# EAGLE design fite-controller-1-main (EAGLE 6.5.0)

## Sheet 1 of 2
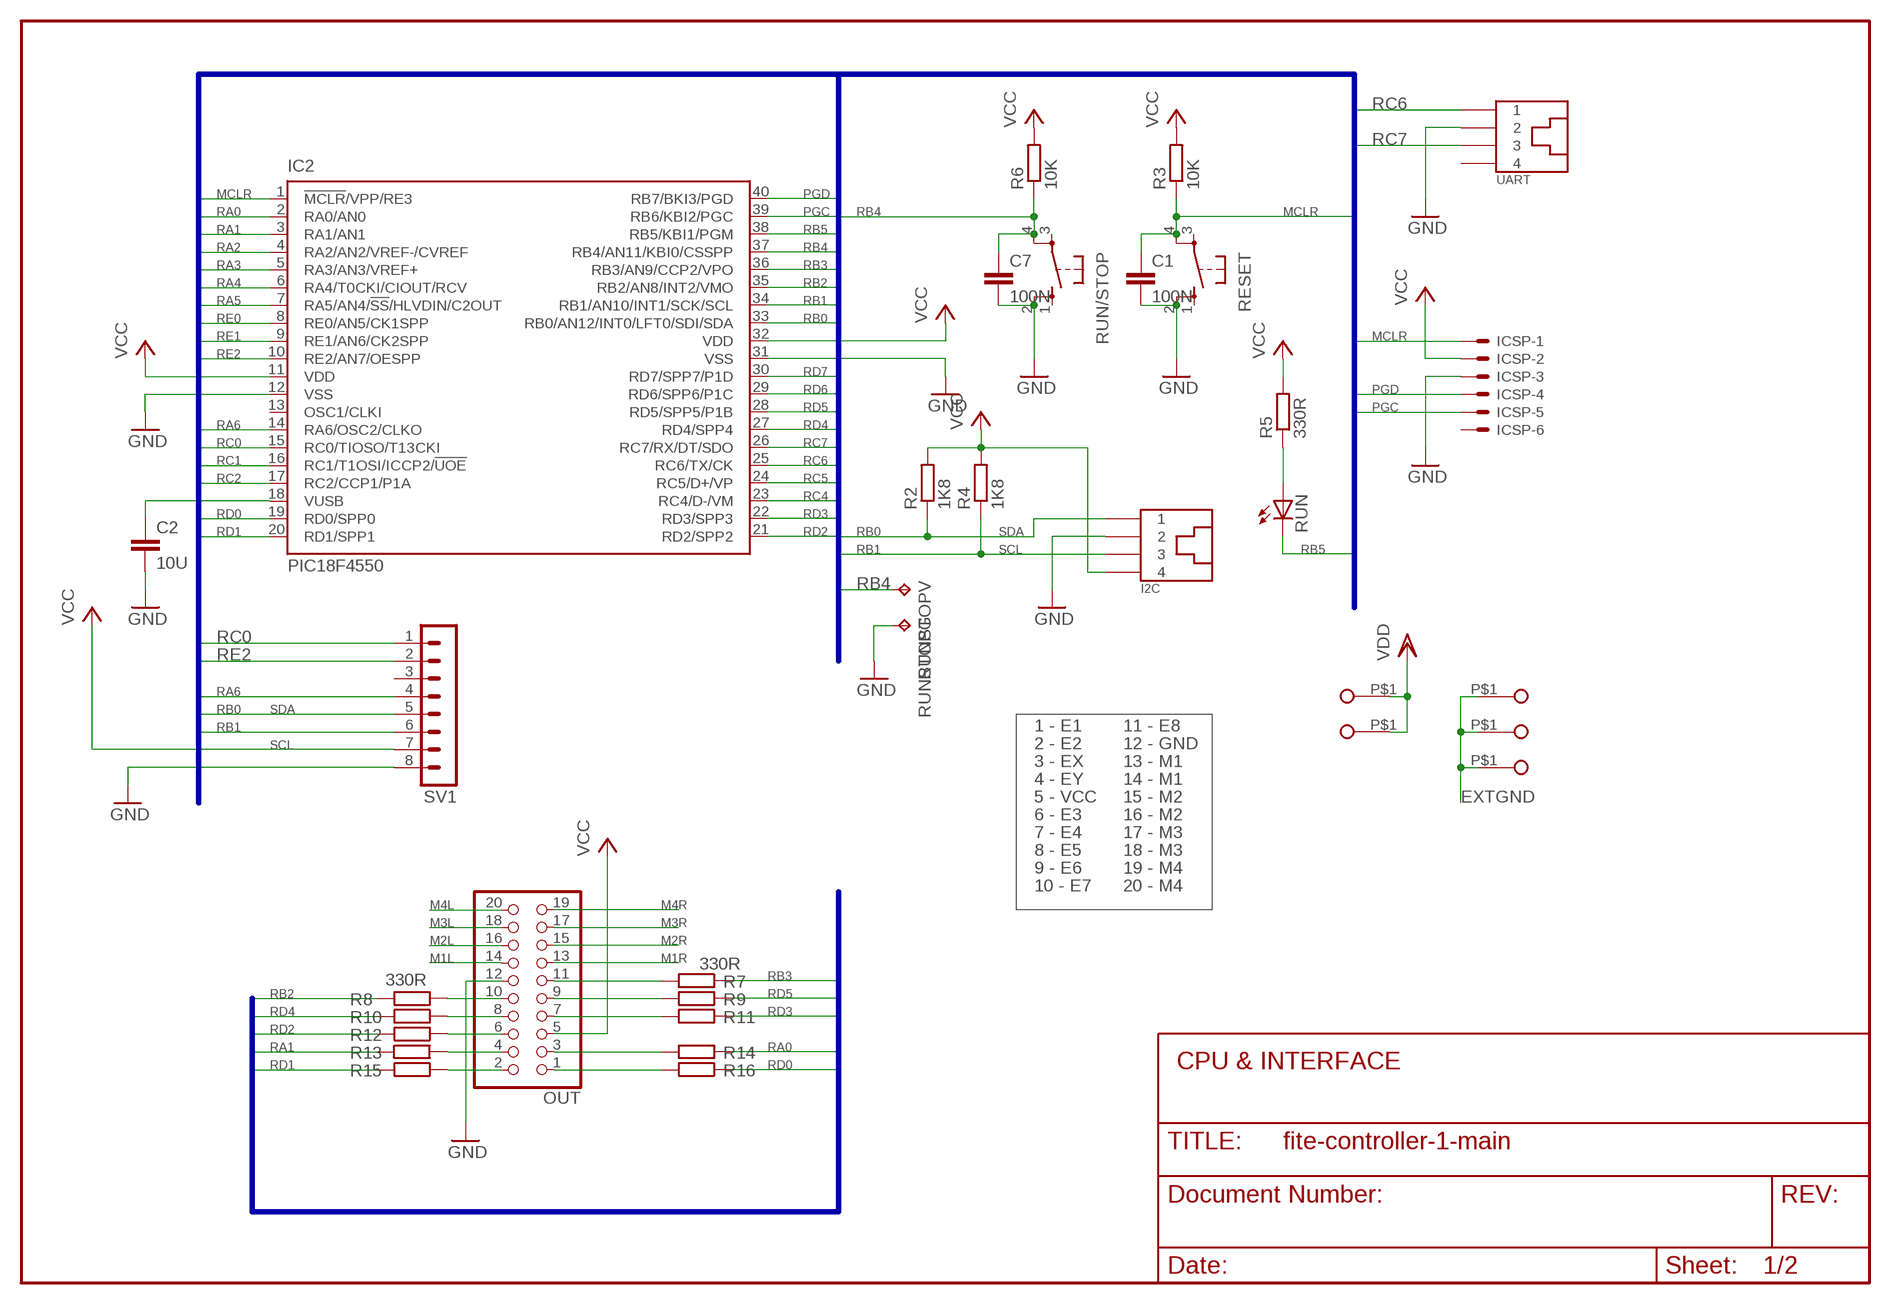
[diagram p0: schematic, sheet 1]

### Parts
C1  100N  C-EU025-025X050  [C025-025X050]
C2  10U  C-EU025-025X050  [C025-025X050]
C7  100N  C-EU025-025X050  [C025-025X050]
I2C  PC_INTERNAL_AUDIO_4  [PC_INTERNAL_AUDIO_4]
IC2  PIC18F4550  PIC18F4550_40  [DIL40]
ICSP  22-23-2061  [22-23-2061]
OUT  PINHD-2X10  [2X10]
R2  1K8  R-EU_0207/10  [0207/10]
R3  10K  R-EU_0207/10  [0207/10]
R4  1K8  R-EU_0207/10  [0207/10]
R5  330R  R-EU_0207/10  [0207/10]
R6  10K  R-EU_0207/10  [0207/10]
R7  330R  R-EU_0207/10  [0207/10]
R8  330R  R-EU_0207/10  [0207/10]
R9  330R  R-EU_0207/10  [0207/10]
R10  330R  R-EU_0207/10  [0207/10]
R11  330R  R-EU_0207/10  [0207/10]
R12  330R  R-EU_0207/10  [0207/10]
R13  330R  R-EU_0207/10  [0207/10]
R14  330R  R-EU_0207/10  [0207/10]
R15  330R  R-EU_0207/10  [0207/10]
R16  330R  R-EU_0207/10  [0207/10]
RESET  10XX  [B3F-10XX]
RUN  LED3MM  [LED3MM]
RUN/STOP  10XX  [B3F-10XX]
RUNSTOPG  TPPAD1-13Y  [P1-13Y]
RUNSTOPV  TPPAD1-13Y  [P1-13Y]
SV1  MA08-1  [MA08-1]
UART  PC_INTERNAL_AUDIO_4  [PC_INTERNAL_AUDIO_4]
VBB_GND_1  FITE_HUELSE  [HUELSE_3.2MM]
VDD_1  FITE_HUELSE  [HUELSE_3.2MM]
VDD_2  FITE_HUELSE  [HUELSE_3.2MM]
VDD_GND  FITE_HUELSE  [HUELSE_3.2MM]
VDD_GND_2  FITE_HUELSE  [HUELSE_3.2MM]

### Nets
EXTGND: VBB_GND_1.P$1 VDD_GND.P$1 VDD_GND_2.P$1 ; also sheet 2
GND: C1.2 C2.2 C7.2 I2C.P$2 IC2.12(VSS) IC2.31(VSS) ICSP.3 OUT.12 RESET.2 RUN/STOP.2 RUNSTOPG.TP SV1.8 UART.P$2 ; also sheet 2
LEDRUN-01: R5.1 RUN.A
M1L: OUT.14 ; also sheet 2
M1R: OUT.13 ; also sheet 2
M2L: OUT.16 ; also sheet 2
M2R: OUT.15 ; also sheet 2
M3L: OUT.18 ; also sheet 2
M3R: OUT.17 ; also sheet 2
M4L: OUT.20 ; also sheet 2
M4R: OUT.19 ; also sheet 2
MCLR: C1.1 IC2.1(!MCLR!/VPP/RE3) ICSP.1 R3.1 RESET.4
N$1: C2.1 IC2.18(VUSB)
N$3: OUT.10 R8.1
N$4: OUT.8 R10.1
N$5: OUT.6 R12.1
N$6: OUT.4 R13.2
N$7: OUT.2 R15.1
N$8: OUT.11 R7.2
N$9: OUT.9 R9.2
N$10: OUT.7 R11.2
N$11: OUT.3 R14.2
N$12: OUT.1 R16.2
PGC: IC2.39(RB6/KBI2/PGC) ICSP.5
PGD: IC2.40(RB7/BKI3/PGD) ICSP.4
RA0: IC2.2(RA0/AN0) R14.1
RA1: IC2.3(RA1/AN1) R13.1
RA2: IC2.4(RA2/AN2/VREF-/CVREF) ; also sheet 2
RA3: IC2.5(RA3/AN3/VREF+) ; also sheet 2
RA4: IC2.6(RA4/T0CKI/CIOUT/RCV) ; also sheet 2
RA5: IC2.7(RA5/AN4/!SS!/HLVDIN/C2OUT) ; also sheet 2
RA6: IC2.14(RA6/OSC2/CLKO) SV1.4
RB0: I2C.P$1 IC2.33(RB0/AN12/INT0/LFT0/SDI/SDA) R2.1 SV1.5
RB1: I2C.P$3 IC2.34(RB1/AN10/INT1/SCK/SCL) R4.1 SV1.6
RB2: IC2.35(RB2/AN8/INT2/VMO) R8.2
RB3: IC2.36(RB3/AN9/CCP2/VPO) R7.1
RB4: C7.1 IC2.37(RB4/AN11/KBI0/CSSPP) R6.1 RUN/STOP.4 RUNSTOPV.TP
RB5: IC2.38(RB5/KBI1/PGM) RUN.K(C)
RC0: IC2.15(RC0/TIOSO/T13CKI) SV1.1
RC1: IC2.16(RC1/T1OSI/ICCP2/!UOE) ; also sheet 2
RC2: IC2.17(RC2/CCP1/P1A) ; also sheet 2
RC4: IC2.23(RC4/D-/VM) ; also sheet 2
RC5: IC2.24(RC5/D+/VP) ; also sheet 2
RC6: IC2.25(RC6/TX/CK) UART.P$1
RC7: IC2.26(RC7/RX/DT/SDO) UART.P$3
RD0: IC2.19(RD0/SPP0) R16.1
RD1: IC2.20(RD1/SPP1) R15.2
RD2: IC2.21(RD2/SPP2) R12.2
RD3: IC2.22(RD3/SPP3) R11.1
RD4: IC2.27(RD4/SPP4) R10.2
RD5: IC2.28(RD5/SPP5/P1B) R9.1
RD6: IC2.29(RD6/SPP6/P1C) ; also sheet 2
RD7: IC2.30(RD7/SPP7/P1D) ; also sheet 2
RE0: IC2.8(RE0/AN5/CK1SPP) ; also sheet 2
RE1: IC2.9(RE1/AN6/CK2SPP) ; also sheet 2
RE2: IC2.10(RE2/AN7/OESPP) SV1.2
VCC: I2C.P$4 IC2.11(VDD) IC2.32(VDD) ICSP.2 OUT.5 R2.2 R3.2 R4.2 R5.2 R6.2 SV1.7 ; also sheet 2
VDD: VDD_1.P$1 VDD_2.P$1 ; also sheet 2
Unconnected: IC2.13(OSC1/CLKI) ICSP.6 RESET.1 RESET.3 RUN/STOP.1 RUN/STOP.3 SV1.3 UART.P$4

### Buses
PICBUS:RA[0..7],RB[0..7],RC[0..7],RD[0..7],RE[0..2],MCLR,PGD,PGC

### Notes on the sheet
- SDA
- SCL
- SDA
- 1 - E1 | 11 - E8
- SCL | 2 - E2 | 12 - GND
- 3 - EX | 13 - M1
- 4 - EY | 14 - M1
- 5 - VCC | 15 - M2
- 6 - E3 | 16 - M2
- 7 - E4 | 17 - M3
- 8 - E5 | 18 - M3
- 9 - E6 | 19 - M4
- 10 - E7 | 20 - M4
- CPU & INTERFACE

## Sheet 2 of 2
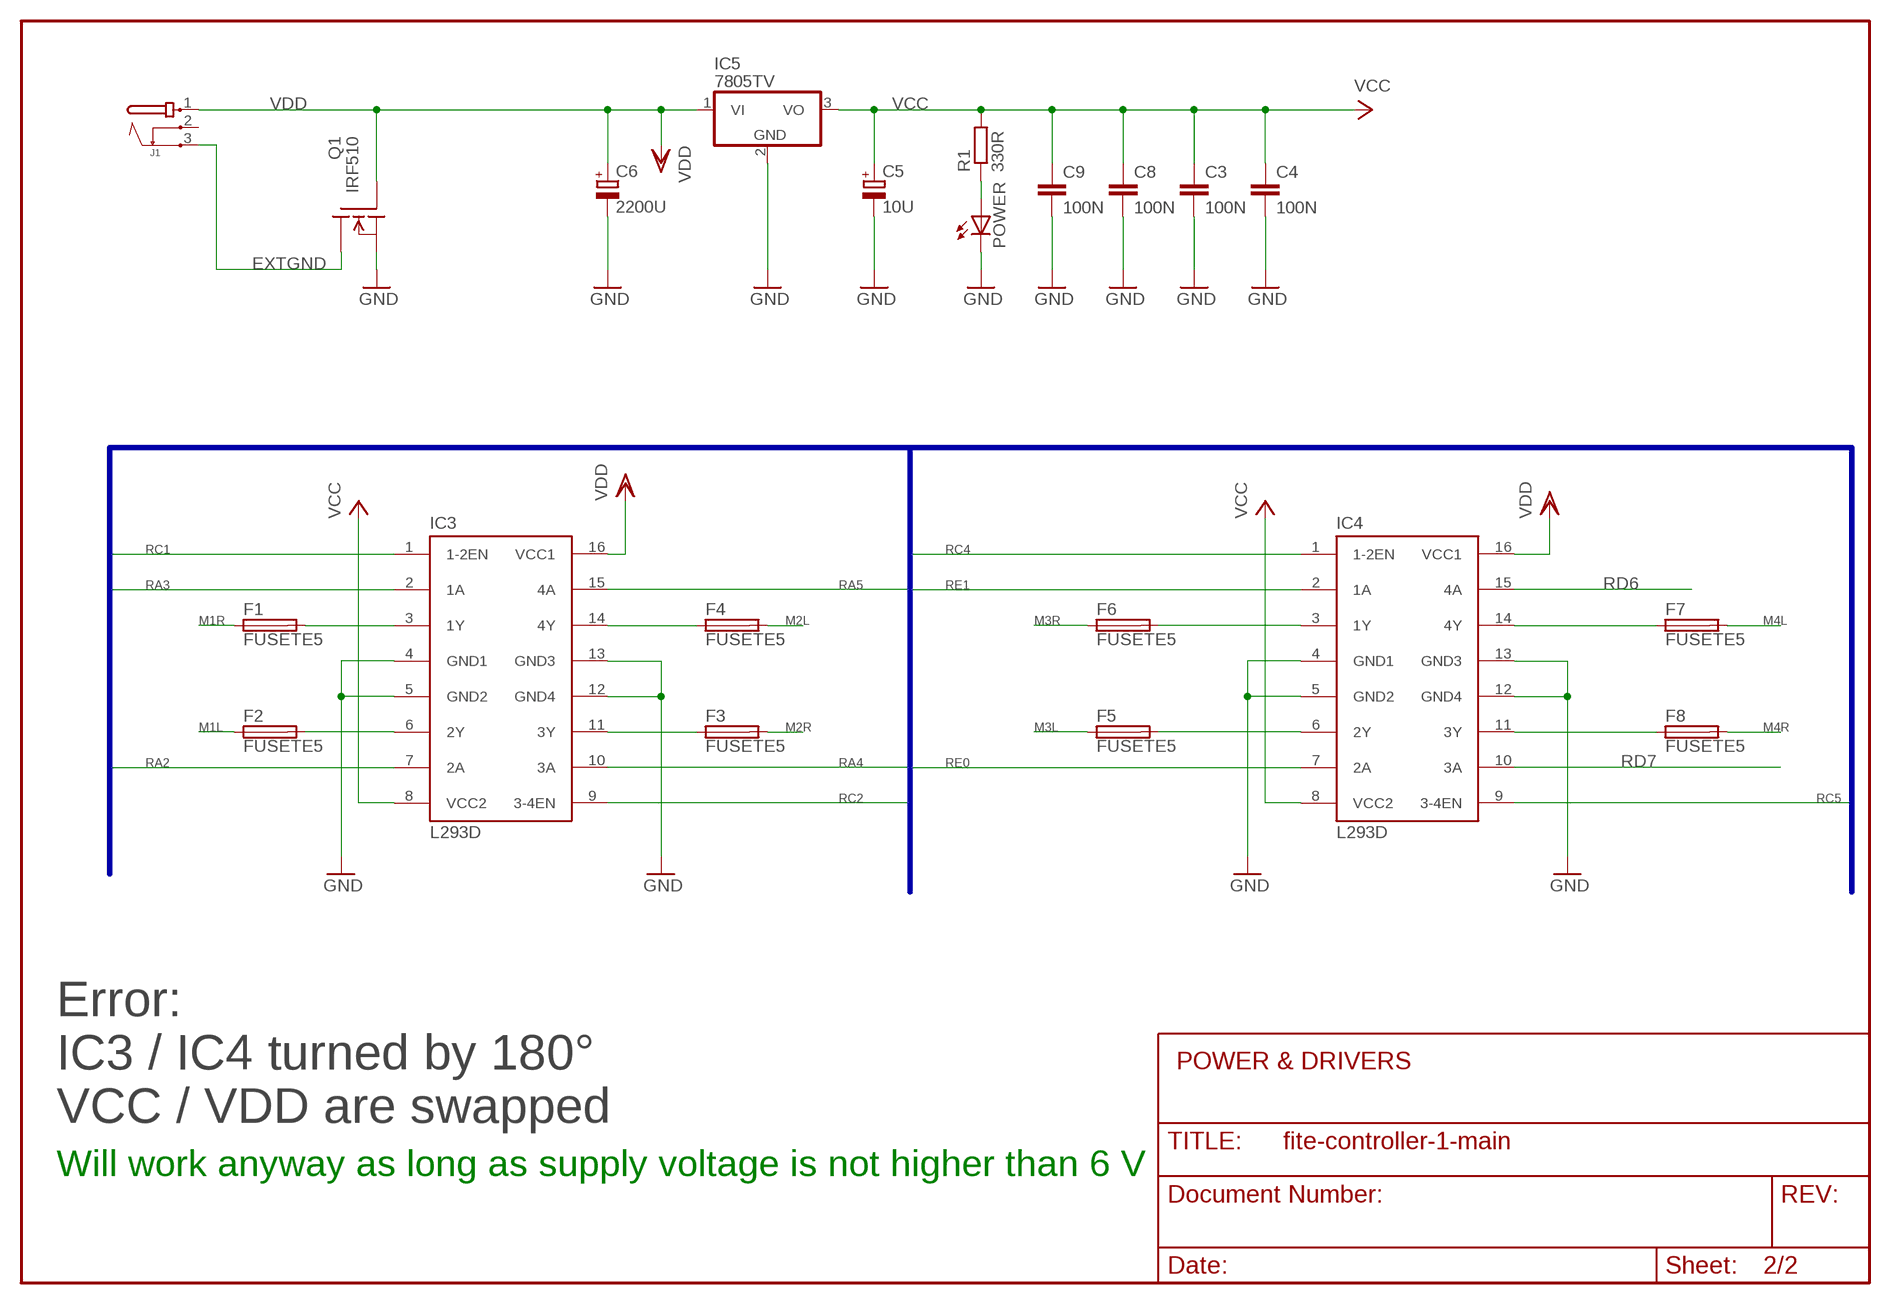
[diagram p1: schematic, sheet 2]

### Parts
C3  100N  C-EU025-025X050  [C025-025X050]
C4  100N  C-EU025-025X050  [C025-025X050]
C5  10U  CPOL-EUE2-4  [E2-4]
C6  2200U  CPOL-EUE3.5-10  [E3,5-10]
C8  100N  C-EU025-025X050  [C025-025X050]
C9  100N  C-EU025-025X050  [C025-025X050]
F1  FUSETE5  [TE5]
F2  FUSETE5  [TE5]
F3  FUSETE5  [TE5]
F4  FUSETE5  [TE5]
F5  FUSETE5  [TE5]
F6  FUSETE5  [TE5]
F7  FUSETE5  [TE5]
F8  FUSETE5  [TE5]
IC3  L293D  L293E  [DIL16]
IC4  L293D  L293E  [DIL16]
IC5  7805TV  [TO220V]
J1  JACK-PMS  [JACK-PMS]
POWER  LED3MM  [LED3MM]
Q1  IRF510  [TO220]
R1  330R  R-EU_0207/10  [0207/10]

### Nets
EXTGND: J1.3 Q1.2(D) ; also sheet 1
GND: C3.2 C4.2 C5.- C6.- C8.2 C9.2 IC3.4(GND1) IC3.5(GND2) IC3.12(GND4) IC3.13(GND3) IC4.4(GND1) IC4.5(GND2) IC4.12(GND4) IC4.13(GND3) IC5.2(GND) POWER.K(C) Q1.3(S) ; also sheet 1
LEDPWR-01: POWER.A R1.1
M1L: F2.1 ; also sheet 1
M1L-01: F2.2 IC3.6(2Y)
M1R: F1.1 ; also sheet 1
M1R-01: F1.2 IC3.3(1Y)
M2L: F4.2 ; also sheet 1
M2L-01: F4.1 IC3.14(4Y)
M2R: F3.2 ; also sheet 1
M2R-01: F3.1 IC3.11(3Y)
M3L: F5.1 ; also sheet 1
M3L-01: F5.2 IC4.6(2Y)
M3R: F6.1 ; also sheet 1
M3R-01: F6.2 IC4.3(1Y)
M4L: F7.2 ; also sheet 1
M4L-01: F7.1 IC4.14(4Y)
M4R: F8.2 ; also sheet 1
M4R-01: F8.1 IC4.11(3Y)
RA2: IC3.7(2A) ; also sheet 1
RA3: IC3.2(1A) ; also sheet 1
RA4: IC3.10(3A) ; also sheet 1
RA5: IC3.15(4A) ; also sheet 1
RC1: IC3.1(1-2EN) ; also sheet 1
RC2: IC3.9(3-4EN) ; also sheet 1
RC4: IC4.1(1-2EN) ; also sheet 1
RC5: IC4.9(3-4EN) ; also sheet 1
RD6: IC4.15(4A) ; also sheet 1
RD7: IC4.10(3A) ; also sheet 1
RE0: IC4.7(2A) ; also sheet 1
RE1: IC4.2(1A) ; also sheet 1
VCC: C3.1 C4.1 C5.+ C8.1 C9.1 IC3.8(VCC2) IC4.8(VCC2) IC5.3(VO) R1.2 ; also sheet 1
VDD: C6.+ IC3.16(VCC1) IC4.16(VCC1) IC5.1(VI) J1.1 Q1.1(G) ; also sheet 1
Unconnected: J1.2

### Buses
PICBUS:RA[0..7],RB[0..7],RC[0..7],RD[0..7],RE[0..2],MCLR,PGD,PGC

### Notes on the sheet
- Error:
- IC3 / IC4 turned by 180° | POWER & DRIVERS
- VCC / VDD are swapped
- Will work anyway as long as supply voltage is not higher than 6 V

## Library data of the parts
C1-C4 C7-C9 = turbod3:C-EU: CAPACITOR, European symbol
C5 C6 = rcl:CPOL-EU: POLARIZED CAPACITOR, European symbol
F1-F8 = fuse:FUSE: Fuse; OC_FARNELL: unknown; OC_NEWARK: unknown
I2C UART = turbod3:PC_INTERNAL_AUDIO_4
IC2 = microchip:PIC18F4*_40: USB Microcontrollers with nanoWatt Technology High-Performance, Enhanced Flash, 28/40/44-Pin, Source: http://ww1.microchip.com/downloads/en/devicedoc/39632c.pdf; MF: MICROCHIP; MPN: PIC18F4550-I/P; OC_FARNELL: 9321357; OC_NEWARK: 74K8623
IC3 IC4 = texas:L293E: TI DEVICE; MF: Arrow Electronics; MPN: L293E; OC_FARNELL: 1467711; OC_NEWARK: 89K0732
IC5 = linear:78*: Positive VOLTAGE REGULATOR Source: http://cache.national.com/ds/LM/LM78L05.pdf http://www.fairchildsemi.com/ds/LM/LM7805.pdf
ICSP = con-molex:22-23-2061: .100" (2.54mm) Center Header - 6 Pin; MF: MOLEX; MPN: 22-23-2061; OC_FARNELL: 1462922; OC_NEWARK: 27C1933
J1 = POWER-IN:JACK-PMS
OUT = pinhead:PINHD-2X10: PIN HEADER
POWER RUN = led:LED: LED OSRAM: - CHIPLED LG R971, LG N971, LY N971, LG Q971, LY Q971, LO R971, LY R971 LH N974, LH R974 LS Q976, LO Q976, LY Q976 LO Q996 - Hyper CHIPLED LW Q18S LB Q993, LB Q99A, LB R99A - SideLED LS A670, LO A670, LY A670, LG A670, LP A670 LB A673, LV A673, LT A673, LW A673 LH A674 LY A675 LS A676, LA A676, LO A676, LY A676, LW A676 LS A679, LY A679, LG A679 - Hyper Micro SIDELED® LS Y876, LA Y876, LO Y876, LY Y876 LT Y87S - SmartLED LW L88C, LW L88S LB L89C, LB L89S, LG L890 LS L89K, LO L89K, LY L89K LS L896, LA L896, LO L896, LY L896 - TOPLED LS T670, LO T670, LY T670, LG T670, LP T670 LSG T670, LSP T670, LSY T670, LOP T670, LYG T670 LG T671, LOG T671, LSG T671 LB T673, LV T673, LT T673, LW T673 LH T674 LS T676, LA T676, LO T676, LY T676, LB T676, LH T676, LSB T676, LW T676 LB T67C, LV T67C, LT T67C, LS T67K, LO T67K, LY T67K, LW E67C LS E67B, LA E67B, LO E67B, LY E67B, LB E67C, LV E67C, LT E67C LW T67C LS T679, LY T679, LG T679 LS T770, LO T770, LY T770, LG T770, LP T770 LB T773, LV T773, LT T773, LW T773 LH T774 LS E675, LA E675, LY E675, LS T675 LS T776, LA T776, LO T776, LY T776, LB T776 LHGB T686 LT T68C, LB T68C - Hyper Mini TOPLED® LB M676 - Mini TOPLED Santana® LG M470 LS M47K, LO M47K, LY M47K Source: http://www.osram.convergy.de LUXEON: - LUMILED® LXK2-PW12-R00, LXK2-PW12-S00, LXK2-PW14-U00, LXK2-PW14-V00 LXK2-PM12-R00, LXK2-PM12-S00, LXK2-PM14-U00 LXK2-PE12-Q00, LXK2-PE12-R00, LXK2-PE12-S00, LXK2-PE14-T00, LXK2-PE14-U00 LXK2-PB12-K00, LXK2-PB12-L00, LXK2-PB12-M00, LXK2-PB14-N00, LXK2-PB14-P00, LXK2-PB14-Q00 LXK2-PR12-L00, LXK2-PR12-M00, LXK2-PR14-Q00, LXK2-PR14-R00 LXK2-PD12-Q00, LXK2-PD12-R00, LXK2-PD12-S00 LXK2-PH12-R00, LXK2-PH12-S00 LXK2-PL12-P00, LXK2-PL12-Q00, LXK2-PL12-R00 Source: www.luxeon.com KINGBRIGHT: KA-3528ASYC Source: www.kingbright.com
Q1 = transistor-fet:IRF510: N-Channel Enhancement MOSFET (HEXFET); 100V; 5,6A; 0,54Ohm
R1-R16 = turbod3:R-EU_: RESISTOR, European symbol
RESET RUN/STOP = turbod3:10XX
RUNSTOPG RUNSTOPV = testpad:TP: Test pad
SV1 = con-lstb:MA08-1: PIN HEADER; OC_FARNELL: unknown; OC_NEWARK: unknown
VBB_GND_1 VDD_1 VDD_2 VDD_GND VDD_GND_2 = turbod3:FITE_HUELSE

## Board
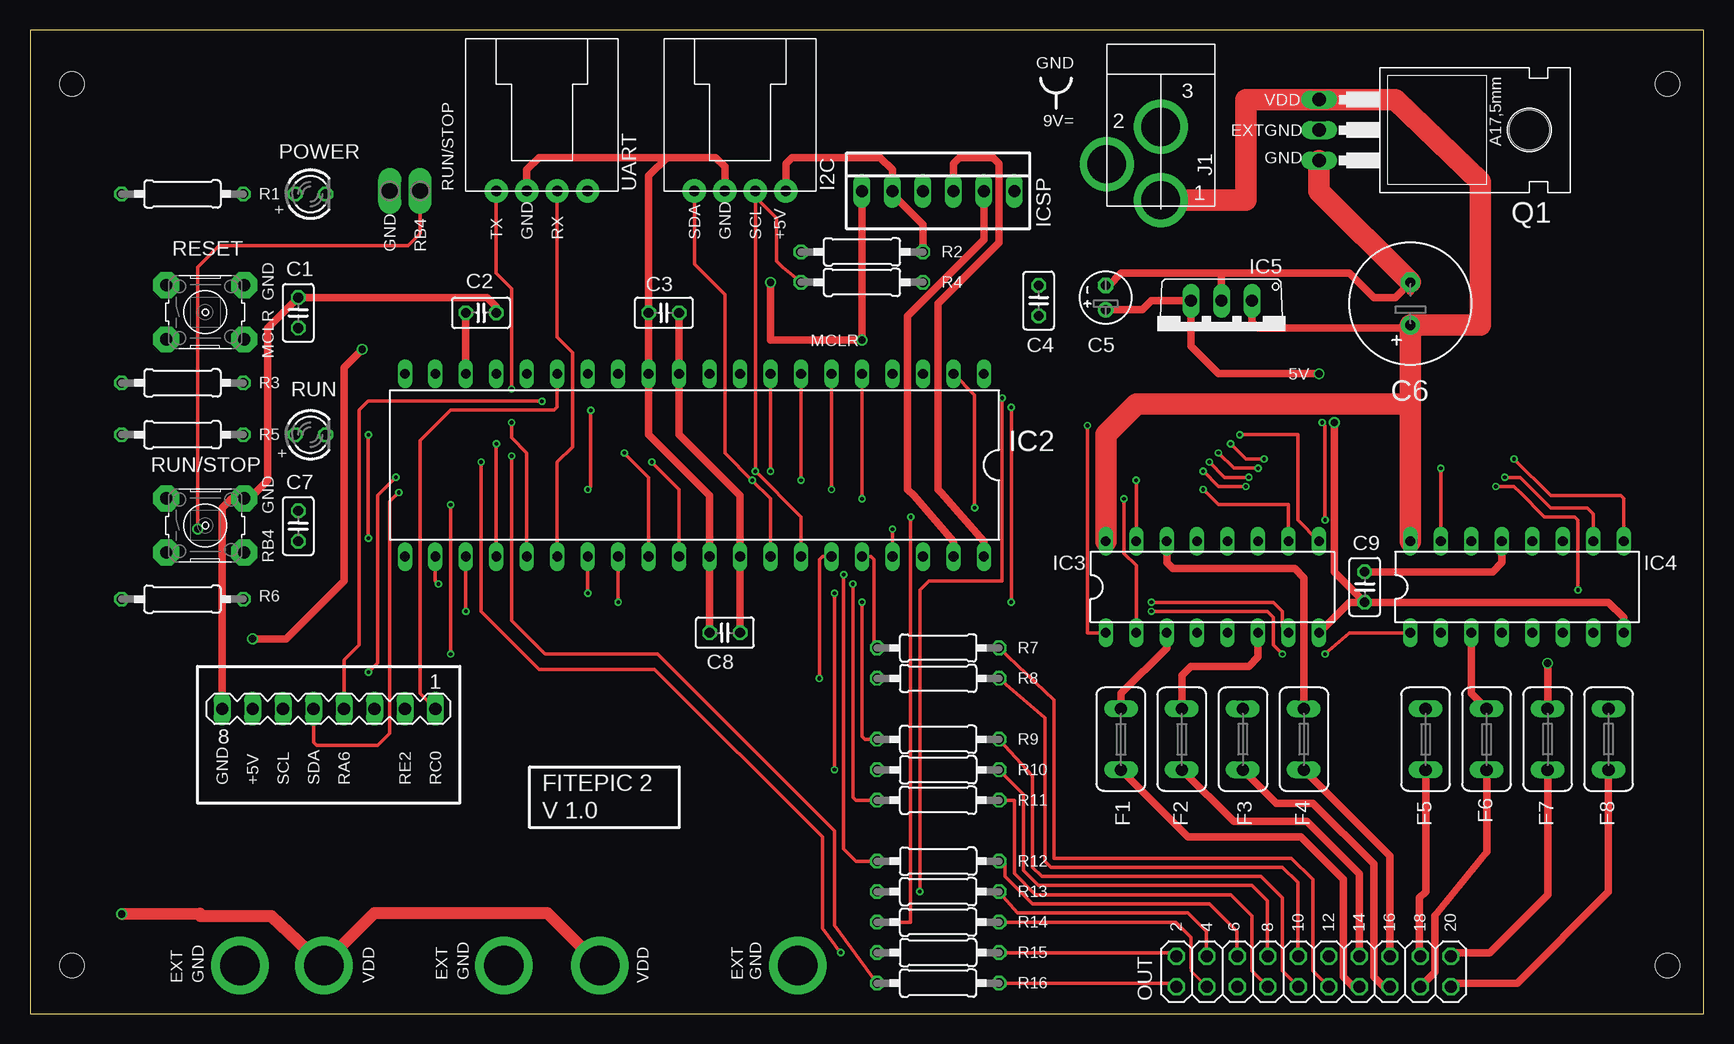
[diagram p2: board, top side]
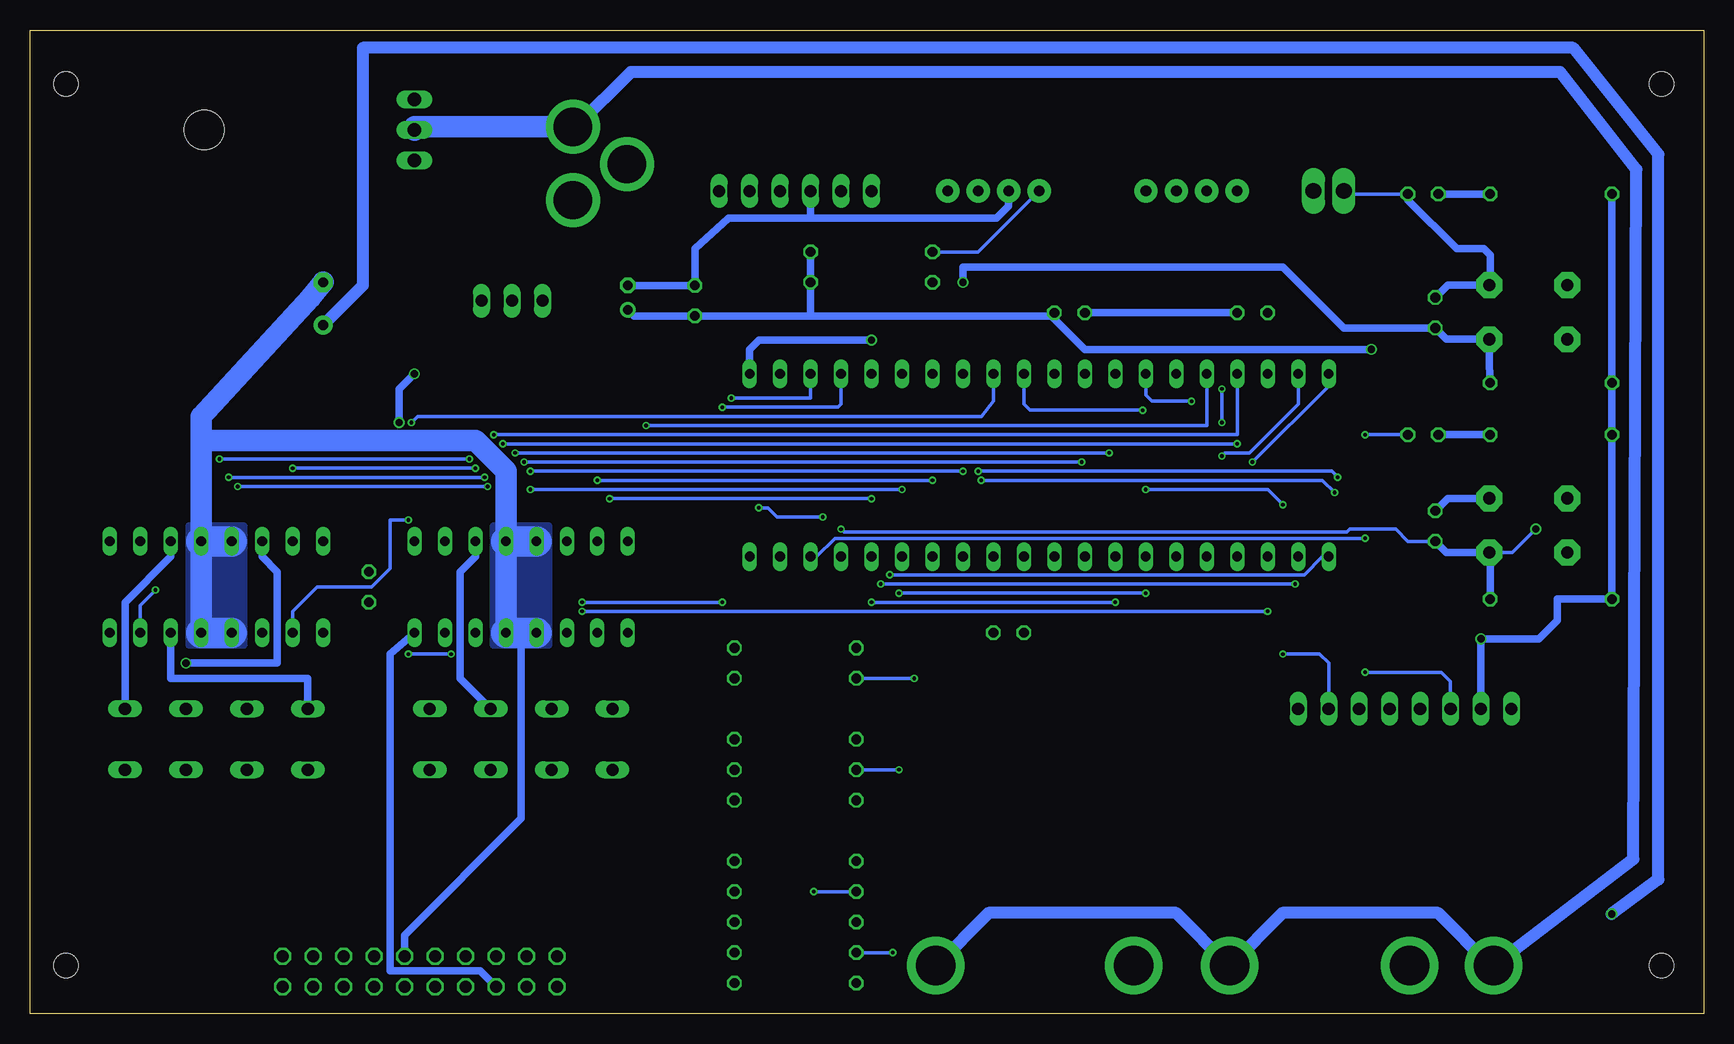
[diagram p3: board, bottom side, seen from below]

Size 139.5 x 82 mm. Coordinates in mm from the lower left corner, seen from the top.
Outline: 0,0 139.5,0 139.5,82 0,82 0,0
Copper layers (1*16): Top 0.035mm / dielectric 1.5mm / Bottom 0.035mm
Design rules "PCB-POOL Standard": minimum track width 0.15mm, minimum drill 0.3mm, track to track 0.15mm, track to pad 0.15mm, pad to pad 0.15mm, via to via 0.15mm, smd to smd 0.15mm, copper to edge 0.3mm, drill to drill 0.2mm, minimum pad ring 0.2mm, minimum via ring 0.15mm, stop-mask expansion 0.075mm, vias tented up to drill 0mil, thermal gap 0.2mm
Holes 2 mm at 3.5,77.5 3.5,4 136.5,77.5 136.5,4

### Footprints (pad centres in the part's own frame; a part is rotated, then mirrored left to right if it is on the bottom)
C025-025X050 = drill 0.813 octagon: 1 -1.27,0; 2 1.27,0
E2-4 = drill 0.813 pad 1.27 round: + -1.016,0 | drill 0.813 pad 1.27 octagon: - 1.016,0
E3,5-10 = drill 0.813 pad 1.6 round: + -1.778,0 | drill 0.813 pad 1.6 octagon: - 1.778,0
TE5 = drill 1.016 long: 1 -2.54,0; 2 2.54,0
PC_INTERNAL_AUDIO_4 = drill 0.9 pad 1.93 round: P$1 -3.81,-6.35; P$2 -1.27,-6.35; P$3 1.27,-6.35; P$4 3.81,-6.35
DIL40 = drill 0.813 long: 1 -24.13,-7.62; 2 -21.59,-7.62; 3 -19.05,-7.62; 4 -16.51,-7.62; 5 -13.97,-7.62; 6 -11.43,-7.62; 7 -8.89,-7.62; 8 -6.35,-7.62; 9 -3.81,-7.62; 10 -1.27,-7.62; 11 1.27,-7.62; 12 3.81,-7.62; 13 6.35,-7.62; 14 8.89,-7.62; 15 11.43,-7.62; 16 13.97,-7.62; 17 16.51,-7.62; 18 19.05,-7.62; 19 21.59,-7.62; 20 24.13,-7.62; 21 24.13,7.62; 22 21.59,7.62; 23 19.05,7.62; 24 16.51,7.62; 25 13.97,7.62; 26 11.43,7.62; 27 8.89,7.62; 28 6.35,7.62; 29 3.81,7.62; 30 1.27,7.62; 31 -1.27,7.62; 32 -3.81,7.62; 33 -6.35,7.62; 34 -8.89,7.62; 35 -11.43,7.62; 36 -13.97,7.62; 37 -16.51,7.62; 38 -19.05,7.62; 39 -21.59,7.62; 40 -24.13,7.62
DIL16 = drill 0.813 long: 1 -8.89,-3.81; 2 -6.35,-3.81; 3 -3.81,-3.81; 4 -1.27,-3.81; 5 1.27,-3.81; 6 3.81,-3.81; 7 6.35,-3.81; 8 8.89,-3.81; 9 8.89,3.81; 10 6.35,3.81; 11 3.81,3.81; 12 1.27,3.81; 13 -1.27,3.81; 14 -3.81,3.81; 15 -6.35,3.81; 16 -8.89,3.81
TO220V = drill 1.016 long: 1 -2.54,-2.54; 2 0,-2.54; 3 2.54,-2.54
22-23-2061 = drill 1 long: 1 -6.35,0; 2 -3.81,0; 3 -1.27,0; 4 1.27,0; 5 3.81,0; 6 6.35,0
JACK-PMS = drill 3.2 pad 4.5 round: 1 -0.5,-3.31; 2 -5,-0.31; 3 -0.5,2.809
2X10 = drill 1.016 octagon: 1 -11.43,-1.27; 2 -11.43,1.27; 3 -8.89,-1.27; 4 -8.89,1.27; 5 -6.35,-1.27; 6 -6.35,1.27; 7 -3.81,-1.27; 8 -3.81,1.27; 9 -1.27,-1.27; 10 -1.27,1.27; 11 1.27,-1.27; 12 1.27,1.27; 13 3.81,-1.27; 14 3.81,1.27; 15 6.35,-1.27; 16 6.35,1.27; 17 8.89,-1.27; 18 8.89,1.27; 19 11.43,-1.27; 20 11.43,1.27
LED3MM = drill 0.813 octagon: A -1.27,0; K 1.27,0
TO220 = drill 1.118 long: 1 -2.54,-6.35; 2 0,-6.35; 3 2.54,-6.35 | hole 3.302: 0,11.176
0207/10 = drill 0.813 octagon: 1 -5.08,0; 2 5.08,0
B3F-10XX = drill 1.016 pad 2.159 octagon: 1 -3.379,2.312; 2 3.123,2.312; 3 -3.379,-2.209; 4 3.123,-2.209
P1-13Y = drill 1.321 pad 1.905 long: TP 0,0
MA08-1 = drill 1.016 long: 1 -8.89,0; 2 -6.35,0; 3 -3.81,0; 4 -1.27,0; 5 1.27,0; 6 3.81,0; 7 6.35,0; 8 8.89,0
HUELSE_3.2MM = drill 3.3 pad 4.8 round: P$1 0,0

### Placement (x,y rotation side)
C1  22.36,58.42 90 top
C2  37.6,58.42 0 top
C3  52.84,58.42 180 top
C4  84.08,59.44 90 top
C5  89.67,59.69 90 top
C6  115.07,59.18 90 top
C7  22.36,40.64 90 top
C8  57.92,31.75 180 top
C9  111.26,35.56 90 top
F1  90.94,22.86 90 top
F2  96.02,22.86 90 top
F3  101.1,22.86 270 top
F4  106.18,22.86 270 top
F5  116.34,22.86 90 top
F6  121.42,22.86 90 top
F7  126.5,22.86 270 top
F8  131.58,22.86 270 top
I2C  59.19,74.93 0 top
IC2  55.38,45.72 180 top
IC3  98.56,35.56 0 top
IC4  123.96,35.56 0 top
IC5  99.32,56.9 180 top
ICSP  75.7,68.58 0 top
J1  94.75,71.12 0 top
OUT  107,3.5 0 top
POWER  23.38,68.33 0 top
Q1  113.8,73.66 270 top
R1  12.71,68.33 180 top
R2  69.35,63.5 0 top
R3  12.71,52.58 180 top
R4  69.35,60.96 0 top
R5  12.71,48.26 180 top
R6  12.71,34.54 180 top
R7  75.7,30.48 0 top
R8  75.7,27.94 180 top
R9  75.7,22.86 0 top
R10  75.7,20.32 180 top
R11  75.7,17.78 0 top
R12  75.7,12.7 180 top
R13  75.7,10.16 0 top
R14  75.7,7.62 0 top
R15  75.7,5.08 180 top
R16  75.7,2.54 0 top
RESET  14.74,58.42 0 top
RUN  23.38,48.26 0 top
RUN/STOP  14.74,40.64 0 top
RUNSTOPG  29.98,68.58 0 top
RUNSTOPV  32.52,68.58 0 top
SV1  24.9,25.4 180 top
UART  42.68,74.93 0 top
VBB_GND_1  17.5,4 0 top
VDD_1  24.5,4 0 top
VDD_2  47.5,4 0 top
VDD_GND  64,4 0 top
VDD_GND_2  39.5,4 0 top

### Tracks (layer width: path | path; a pad name or v marks a point on that pad's centre or on a via)
EXTGND
  Bottom 1.016: J1.3 93.97,73.93 89.42,78.49 11.95,78.49 5.6,70.36 5.85,12.86 VBB_GND_1.P$1 17.72,4 22.11,8.38 35.12,8.38 VDD_GND_2.P$1 39.57,4 43.95,8.38 59.62,8.38 VDD_GND.P$1
  Bottom 1.778: J1.3 107.45,73.93 Q1.2
GND
  Top 0.61: C8.2 IC2.31 56.65,43.18 51.57,48.26 IC2.12 C3.2 51.57,69.85 53.09,71.37 | IC4.13 122.69,37.59 121.93,36.83 C9.2 | 53.09,71.37 57.16,71.37 57.92,70.61 I2C.P$2 | UART.P$2 41.41,70.36 42.43,71.37 53.09,71.37 | C2.2 38.87,58.93 38.11,59.69 C1.2 19.82,57.15 19.82,44.45 18.32,42.95 RUN/STOP.2 16.8,42.95 16.01,42.16 SV1.8 | C6.- 115.07,60.2 | C6.- 114.69,60.58 | C5.- 89.92,60.71 90.94,61.72 99.32,61.72 | 99.32,61.72 IC5.2 | C6.- 114.31,61.72 | 99.32,61.72 109.99,61.72 112.02,59.69 113.8,59.69 C6.-
  Top 1.778: Q1.3 107.45,68.58 C6.-
  Bottom 0.305: RUNSTOPG.TP 29.98,69.09 29.22,68.33 POWER.K
  Bottom 0.61: C1.2 21.32,60.73 RESET.2 17.79,60.81 17.79,63.25 18.3,63.75 20.58,63.75 24.65,67.82 POWER.K | RUN/STOP.2 21.32,42.95 C7.2 | C5.- C4.2 84.08,63.75 81.29,66.29 74.43,66.29 | I2C.P$2 57.92,67.31 58.94,66.29 74.43,66.29 | C2.2 C3.2 | 99.07,31.75 98.56,31.24 98.56,16.26 108.29,6.53 108.29,4.79 OUT.12 | 74.43,66.29 ICSP.3
  Bottom 1.778: C6.- 116.09,59.69 125.23,49.78 125.23,47.75 | IC4.5 IC4.12 125.23,47.75 | 125.23,47.75 102.37,47.75 99.83,45.21 IC3.12 IC3.5
  Bottom 2.54: IC4.12 IC4.13 | IC4.5 IC4.4 | IC3.12 IC3.13 | IC3.5 99.07,31.75 IC3.4
  pour Bottom (no thermals): 96.27,40.64 100.85,40.64 100.85,30.73 96.27,30.73
  pour Bottom (no thermals): 121.67,40.64 126.25,40.64 126.25,30.73 121.67,30.73
LEDPWR-01
  Bottom 0.61: R1.1 POWER.A
LEDRUN-01
  Bottom 0.61: R5.1 RUN.A
M1L
  Top 0.61: F2.1 100.34,16 106.43,16 110.81,11.63 OUT.14
M1L-01
  Top 0.61: IC3.6 102.37,29.72 101.61,28.96 96.78,28.96 96.02,28.19 F2.2
M1R
  Top 0.61: F1.1 96.53,14.73 105.93,14.73 109.48,11.18 109.48,3.05 110.3,2.23 OUT.13
M1R-01
  Top 0.61: IC3.3 94.75,30.48 90.94,26.67 F1.2
M2L
  Top 0.61: F4.2 113.35,13.14 OUT.16
M2L-01
  Top 0.61: IC3.14 94.75,37.59 95.26,37.08 105.42,37.08 106.18,36.32 F4.1
M2R
  Top 0.61: F3.2 103.89,17.53 106.94,17.53 112.01,12.46 112.01,3.06 112.84,2.23 OUT.15
M2R-01
  Bottom 0.61: IC3.11 102.37,38.1 103.64,36.83 103.64,27.94 F3.1
M3L
  Top 0.61: F5.1 116.34,10.16 115.83,9.65 115.83,4.83 OUT.18
M3L-01
  Bottom 0.61: IC4.6 127.77,27.94 116.34,27.94 F5.2
M3R
  Top 0.61: F6.1 121.42,13.46 117.1,8.13 117.1,3.44 OUT.17
M3R-01
  Top 0.61: IC4.3 120.15,26.67 F6.2
M4L
  Top 0.61: F7.2 126.5,9.91 121.67,5.08 118.38,5.08 118.38,4.82 OUT.20
M4L-01  (via drill 0.6 pad 0.61)
  Top 0.61: v126.5,29.21 F7.1
  Bottom 0.61: IC4.14 120.15,38.1 118.88,36.83 118.88,29.21 v126.5,29.21
M4R
  Top 0.61: F8.2 131.58,10.16 123.96,2.54 118.64,2.54 118.43,2.33 OUT.19
M4R-01
  Bottom 0.61: IC4.11 127.77,38.1 131.58,34.29 F8.1
MCLR  (via drill 0.6 pad 0.3)
  Top 0.61: v61.73,60.96 61.73,56.13 v69.35,56.13 ICSP.1
  Bottom 0.61: R3.1 17.86,54.03 RESET.4 21.42,56.21 C1.1 29.98,57.15 35.06,62.23 61.73,62.23 v61.73,60.96 | IC2.1 79.51,55.37 78.75,56.13 v69.35,56.13
N$1
  Top 0.61: IC2.18 C2.1
N$3
  Top 0.305: R8.1 84.59,24.64 84.59,12.7 85.1,12.19 104.4,12.19 105.67,10.92 105.67,4.83 OUT.10
N$4
  Top 0.305: R10.1 82.81,18.29 82.81,11.94 84.08,10.67 101.86,10.67 103.13,9.4 103.13,5.34 103.19,5.29 OUT.8
N$5
  Top 0.305: R12.1 81.29,12.7 81.29,11.43 83.57,9.14 98.31,9.14 100.59,6.86 100.59,5.33 100.65,5.28 OUT.6
N$6
  Top 0.254: OUT.4 98.11,5.29 98.05,5.34
  Top 0.305: R13.2 82.3,8.38 96.53,8.38 98.05,6.86 98.05,5.34
N$7
  Top 0.254: OUT.2 95.57,5.01 95.5,5.08
  Top 0.305: R15.1 95.5,5.08 95.59,5.08
N$8
  Top 0.305: R7.2 85.35,26.16 85.35,12.95 105.16,12.95 106.94,11.18 106.94,3.56 OUT.11
N$9
  Top 0.305: R9.2 83.57,19.81 83.57,12.19 84.34,11.43 102.62,11.43 104.4,9.65 104.4,3.56 OUT.9
N$10
  Top 0.305: R11.2 82.05,17.78 82.05,11.68 83.83,9.91 100.08,9.91 101.86,8.13 101.86,3.56 OUT.7
N$11
  Top 0.254: 96.78,3.82 96.78,3.56 OUT.3
  Top 0.305: R14.2 95.51,7.62 96.78,6.35 96.78,3.82
N$12
  Top 0.254: 95.59,2.54 95.59,2.25 OUT.1
  Top 0.305: R16.2 95.59,2.54
PGC
  Top 0.61: IC2.39 76.97,39.37 73.67,43.18 73.16,43.69 73.16,58.17 79.51,64.52 ICSP.5
PGD
  Top 0.61: IC2.40 79.51,39.37 75.95,43.43 75.7,43.69 75.7,59.18 80.78,64.26 80.78,70.87 80.27,71.37 77.48,71.37 76.97,70.87 ICSP.4
RA0  (via drill 0.3 pad 0.3)
  Top 0.305: v73.41,41.4 73.41,7.62 R14.1 | v78.75,42.16 78.75,51.56 IC2.2
  Bottom 0.305: v73.41,41.4 77.22,41.4 77.99,42.16 v78.75,42.16
RA1  (via drill 0.3 pad 0.3, 0.3 pad 0.61)
  Top 0.305: v81.03,51.31 81.03,36.07 74.94,36.07 74.18,35.31 v74.18,10.16
  Bottom 0.305: IC2.3 74.43,51.31 v81.03,51.31 | R13.1 v74.18,10.16
RA2  (via drill 0.3)
  Top 0.305: v81.8,34.29 v81.8,50.55 | IC3.7 104.4,32.26 104.4,33.53 103.64,34.29 v93.48,34.29
  Bottom 0.305: v81.8,50.55 72.14,50.55 71.89,50.8 IC2.4 | v81.8,34.29 v93.48,34.29
RA3  (via drill 0.3)
  Top 0.305: IC3.2 92.21,37.34 91.19,38.35 v91.19,42.93 | v69.35,42.93 IC2.5
  Bottom 0.305: v69.35,42.93 v91.19,42.93
RA4  (via drill 0.3)
  Top 0.305: IC3.10 104.91,42.42 99.07,42.42 v97.8,43.69 | v66.81,43.69 IC2.6
  Bottom 0.305: v66.81,43.69 v97.8,43.69
RA5  (via drill 0.3)
  Top 0.305: v92.21,44.45 IC3.15 | v64.27,44.45 IC2.7
  Bottom 0.305: v64.27,44.45 v92.21,44.45
RA6  (via drill 0.3 pad 0.61)
  Top 0.305: v42.68,51.05 28.2,51.05 27.44,50.29 27.44,30.73 26.17,29.46 SV1.4
  Bottom 0.305: IC2.14 46.49,51.56 45.98,51.05 v42.68,51.05
RB0  (via drill 0.3 pad 0.61)
  Top 0.305: I2C.P$1 55.38,62.48 57.92,59.94 57.92,46.74 v60.21,44.45 61.73,42.93 IC2.33 | v30.74,43.43 29.98,42.67 29.98,23.37 28.96,22.35 23.88,22.35 23.63,22.61 SV1.5
  Bottom 0.305: v60.21,44.45 31.76,44.45 v30.74,43.43 | R2.1 60.46,63.5 I2C.P$1
RB1  (via drill 0.3 pad 0.61)
  Top 0.305: 60.46,68.07 v60.46,45.21 64.27,41.4 IC2.34 | 60.46,68.07 I2C.P$3 | v30.49,44.7 28.96,43.18 28.96,29.21 v28.2,28.45 | R4.1 62.75,62.23 62.24,62.74 62.24,66.29 60.46,68.07
  Bottom 0.305: v60.46,45.21 31,45.21 v30.49,44.7 | v28.2,28.45 21.85,28.45 21.09,27.69 SV1.6
RB2  (via drill 0.3 pad 0.3)
  Top 0.305: IC2.35 66.05,38.1 65.79,37.85 v65.79,27.94
  Bottom 0.305: v65.79,27.94 R8.2
RB3
  Top 0.305: IC2.36 70.11,38.1 70.37,37.85 70.37,30.48 R7.1
RB4  (via drill 0.3 pad 0.3, 0.6 pad 0.3)
  Top 0.305: v71.89,40.39 IC2.37 | RUNSTOPV.TP 32.52,65.02 31.5,64.01 15.76,64.01 13.98,62.23 v13.98,40.39
  Bottom 0.305: v71.89,40.39 71.64,40.13 29.73,40.13 29.47,40.39 25.66,40.39 24.65,39.37 C7.1 | v13.98,40.39 15.93,38.43 RUN/STOP.4
  Bottom 0.61: C7.1 21.42,38.43 RUN/STOP.4 17.79,38.35 R6.1
RB5  (via drill 0.3 pad 0.3)
  Top 0.305: v28.2,39.62 v28.2,48.26
  Bottom 0.305: IC2.38 73.92,38.1 72.4,39.62 v28.2,39.62 | v28.2,48.26 RUN.K
RC0
  Top 0.305: IC2.15 43.95,50.55 43.7,50.29 35.06,50.29 32.52,47.75 32.52,26.67 SV1.1
RC1  (via drill 0.3 pad 0.3)
  Top 0.305: IC3.1 88.15,31.75 v88.15,49.02
  Bottom 0.305: v88.15,49.02 41.41,49.02 IC2.16
RC2  (via drill 0.3 pad 0.3)
  Top 0.305: IC3.9 105.67,41.15 105.67,48.26 v100.85,48.26
  Bottom 0.305: v100.85,48.26 38.87,48.26 IC2.17
RC4  (via drill 0.3, 0.3 pad 0.61)
  Top 0.305: v36.33,33.53 IC2.23 | v93.48,33.53 103.13,33.53 103.64,33.02 103.64,30.73 v104.4,29.97 | IC4.1 109.99,31.75 v107.96,29.97
  Bottom 0.305: v36.33,33.53 v93.48,33.53 | v104.4,29.97 v107.96,29.97
RC5  (via drill 0.3)
  Top 0.305: IC4.9 132.85,42.93 132.6,43.18 126.75,43.18 v123.71,46.23 | IC2.24 v38.87,47.5 | v100.08,47.5 101.35,46.23 v102.88,46.23
  Bottom 0.305: v102.88,46.23 v123.71,46.23 | v38.87,47.5 v100.08,47.5
RC6  (via drill 0.3 pad 0.3)
  Top 0.305: IC2.25 41.41,46.74 40.14,48.01 v40.14,49.28 | UART.P$1 38.87,61.72 40.14,60.45 v40.14,52.07
  Bottom 0.305: v40.14,49.28 v40.14,52.07
RC7
  Top 0.305: IC2.26 43.95,45.97 45.22,47.24 45.22,55.12 43.95,56.39 UART.P$3
RD0  (via drill 0.3 pad 0.61)
  Top 0.305: v40.14,46.48 40.14,32.77 42.93,29.97 52.33,29.97 67.06,15.24 67.06,7.37 R16.1
  Bottom 0.305: IC2.19 33.79,50.8 37.85,46.74 39.89,46.74 v40.14,46.48
RD1  (via drill 0.3 pad 0.61)
  Top 0.305: v37.6,45.97 37.6,33.53 42.43,28.7 52.08,28.7 66.05,14.73 66.05,7.11 v67.58,5.08
  Bottom 0.305: IC2.20 31.25,52.32 v37.6,45.97 | v67.58,5.08 R15.2
RD2  (via drill 0.3 pad 0.3)
  Top 0.305: v67.83,36.58 67.83,13.72 68.84,12.7 R12.2
  Bottom 0.305: IC2.21 31.76,38.1 33.28,36.58 v67.83,36.58
RD3  (via drill 0.3 pad 0.3, 0.3 pad 0.61)
  Top 0.305: v68.59,35.81 68.59,18.03 68.84,17.78 R11.1 | IC2.22 33.79,36.07 v34.04,35.81
  Bottom 0.305: v34.04,35.81 v68.59,35.81
RD4  (via drill 0.3 pad 0.3)
  Top 0.305: v67.06,35.05 v67.06,20.32 | v46.49,35.05 IC2.27
  Bottom 0.305: v46.49,35.05 v67.06,35.05 | v67.06,20.32 R10.2
RD5  (via drill 0.3 pad 0.3)
  Top 0.305: v69.35,34.29 69.35,23.11 69.6,22.86 R9.1 | v49.03,34.29 IC2.28
  Bottom 0.305: v49.03,34.29 v69.35,34.29
RD6  (via drill 0.3 pad 0.3)
  Top 0.305: IC2.29 51.57,44.7 v49.54,46.74 | v99.07,46.74 100.34,45.47 v102.37,45.47 | v117.61,45.47 IC4.15
  Bottom 0.305: v49.54,46.74 v99.07,46.74 | v102.37,45.47 v117.61,45.47
RD7  (via drill 0.3 pad 0.3)
  Top 0.305: IC2.30 54.11,43.69 v51.82,45.97 | v98.31,45.97 99.58,44.7 v101.61,44.7 | v122.94,44.7 124.21,44.7 126.75,42.16 129.8,42.16 130.31,41.66 IC4.10
  Bottom 0.305: v51.82,45.97 v98.31,45.97 | v101.61,44.7 v122.94,44.7
RE0  (via drill 0.3, 0.3 pad 0.3)
  Top 0.305: v129.04,35.31 129.04,41.15 128.79,41.4 126.25,41.4 124.21,43.43 123.71,43.94 v122.18,43.94 | v61.73,45.21 IC2.8 | v97.8,45.21 99.07,43.94 v101.35,43.94
  Bottom 0.305: IC4.7 130.31,34.04 v129.04,35.31 | v61.73,45.21 v97.8,45.21 | v101.35,43.94 v122.18,43.94
RE1  (via drill 0.3)
  Top 0.305: v107.96,41.15 107.96,49.02 v107.7,49.28
  Bottom 0.305: IC4.2 117.61,33.53 115.58,35.56 111.01,35.56 109.48,37.08 109.48,41.15 v107.96,41.15 | v107.7,49.28 107.2,49.78 60.21,49.78 59.19,51.05 IC2.9
RE2  (via drill 0.3 pad 0.61)
  Top 0.305: v46.74,50.29 46.74,43.94 v46.49,43.69 | v35.06,29.97 v35.06,42.42
  Bottom 0.305: IC2.10 56.65,50.8 56.14,50.29 v46.74,50.29 | v46.49,43.69 36.33,43.69 v35.06,42.42 | v35.06,29.97 32.01,29.97 31.25,29.21 SV1.2
VCC  (via drill 0.6 pad 0.61, 0.61 pad 0.61)
  Top 0.61: C3.1 IC2.11 54.11,48.26 59.19,43.18 IC2.32 C8.1 | C9.1 131.58,34.29 132.85,33.02 IC4.8 | v108.72,49.28 108.72,36.83 C9.1 | C9.1 109.99,34.29 IC3.8 | v18.55,31.24 21.34,31.24 26.17,36.07 26.17,53.85 v27.69,55.37 | R2.2 74.43,65.79 71.89,68.33 ICSP.2 71.89,70.36 70.87,71.37 63.51,71.37 63,70.87 I2C.P$4 | v107.45,53.34 99.07,53.34 96.78,55.63 IC5.3 93.48,59.44 92.72,58.67 C5.+
  Bottom 0.61: v107.45,53.34 108.72,52.07 v108.72,49.28 | 54.36,58.17 C3.1 | SV1.7 v18.55,31.24 13.72,31.24 12.2,32.77 12.2,34.54 R6.2 R5.2 R3.2 R1.2 | v27.69,55.37 51.57,55.37 54.36,58.17 | IC3.8 109.48,29.97 109.48,3.56 101.98,3.56 OUT.5 | 54.36,58.17 74.43,58.17 | 74.43,58.17 C4.1 89.16,58.17 C5.+ | R2.2 R4.2 74.43,58.17
VDD  (via drill 0.61 pad 0.3)
  Top 0.61: C6.+ 115.32,57.15 102.37,57.15 101.86,57.66 IC5.1
  Top 1.016: v7.65,8.3 14.15,8.33 14.2,8.13 20.12,8.13 VDD_1.P$1 24.5,4.17 28.71,8.38 43.12,8.38 VDD_2.P$1
  Top 1.778: J1.1 101.35,67.81 101.35,76.2 Q1.1 113.8,76.2 120.91,69.34 120.91,57.4 C6.+ 115.07,50.8 | 115.07,50.8 IC4.16 | IC3.16 89.67,48.26 92.21,50.8 115.07,50.8
  Bottom 1.016: v7.65,8.3 3.75,11.18 3.75,71.64 10.86,80.52 111.77,80.52 111.77,60.71 C6.+

### Text on the board
tPlace: TX | RX
tNames: GND | VDD | 9V= | EXTGND | GND | RUN/STOP | + | GND | SDA | GND | SCL | +5V | GND | RB4 | GND | MCLR | MCLR | 5V | + | GND | RB4 | GND | +5V | SCL | SDA | RA6 | RE2 | RC0 | FITEPIC 2 | V 1.0 | 2 | 4 | 6 | 8 | 10 | 12 | 14 | 16 | 18 | 20 | EXT | GND | VDD | EXT | GND | VDD | EXT | GND